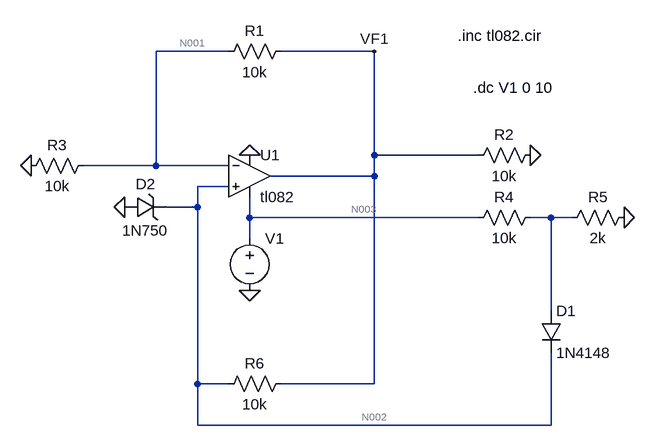
[diagram p0: schematic exp_10_2.asc]
exp_10_2.asc, the LTspice schematic file:
Version 4
SHEET 1 1092 680
WIRE 208 -80 96 -80
WIRE 432 -80 288 -80
WIRE 432 80 432 -80
WIRE 592 80 432 80
WIRE 96 96 96 -80
WIRE 96 96 -16 96
WIRE 208 96 96 96
WIRE 432 112 432 80
WIRE 432 112 272 112
WIRE 208 128 160 128
WIRE 160 160 160 128
WIRE 160 160 112 160
WIRE 240 176 240 144
WIRE 592 176 240 176
WIRE 704 176 672 176
WIRE 736 176 704 176
WIRE 240 208 240 176
WIRE 704 320 704 176
WIRE 160 432 160 160
WIRE 208 432 160 432
WIRE 432 432 432 112
WIRE 432 432 288 432
WIRE 160 496 160 432
WIRE 704 496 704 384
WIRE 704 496 160 496
FLAG 672 80 0
FLAG 816 176 0
FLAG -96 96 0
FLAG 240 80 0
FLAG 240 288 0
FLAG 48 160 0
FLAG 432 -80 VF1
SYMBOL diode 688 320 R0
SYMATTR InstName D1
SYMATTR Value 1N4148
SYMBOL Opamps\\opamp2 240 48 R0
SYMATTR InstName U1
SYMATTR Value tl082
SYMBOL res 304 -96 R90
WINDOW 0 0 56 VBottom 2
WINDOW 3 32 56 VTop 2
SYMATTR InstName R1
SYMATTR Value 10k
SYMBOL res 688 64 R90
WINDOW 0 0 56 VBottom 2
WINDOW 3 32 56 VTop 2
SYMATTR InstName R2
SYMATTR Value 10k
SYMBOL res 0 80 R90
WINDOW 0 0 56 VBottom 2
WINDOW 3 32 56 VTop 2
SYMATTR InstName R3
SYMATTR Value 10k
SYMBOL res 688 160 R90
WINDOW 0 0 56 VBottom 2
WINDOW 3 32 56 VTop 2
SYMATTR InstName R4
SYMATTR Value 10k
SYMBOL res 832 160 R90
WINDOW 0 0 56 VBottom 2
WINDOW 3 32 56 VTop 2
SYMATTR InstName R5
SYMATTR Value 2k
SYMBOL res 304 416 R90
WINDOW 0 0 56 VBottom 2
WINDOW 3 32 56 VTop 2
SYMATTR InstName R6
SYMATTR Value 10k
SYMBOL voltage 240 192 R0
WINDOW 123 0 0 Left 0
WINDOW 39 0 0 Left 0
SYMATTR InstName V1
SYMATTR Value ""
SYMBOL zener 48 176 R270
WINDOW 0 36 32 VTop 2
WINDOW 3 -4 32 VBottom 2
SYMATTR InstName D2
SYMATTR Value 1N750
TEXT 560 -104 Left 2 !.inc tl082.cir
TEXT 584 -24 Left 2 !.dc V1 0 10

The netlist it stands for:
* exp_10_2.asc
D1 N004 N002 1N4148
XU1 N002 N001 0 N003 VF1 tl082  ; pins In+ In- V+ V- OUT
R1 VF1 N001 10k
R2 0 VF1 10k
R3 N001 0 10k
R4 N004 N003 10k
R5 0 N004 2k
R6 VF1 N002 10k
V1 N003 0
D2 0 N002 1N750
.model D D
.lib standard.dio
.inc tl082.cir
.dc V1 0 10
.backanno
.end

* Results of the author's LTspice run, read from the files saved beside the schematic
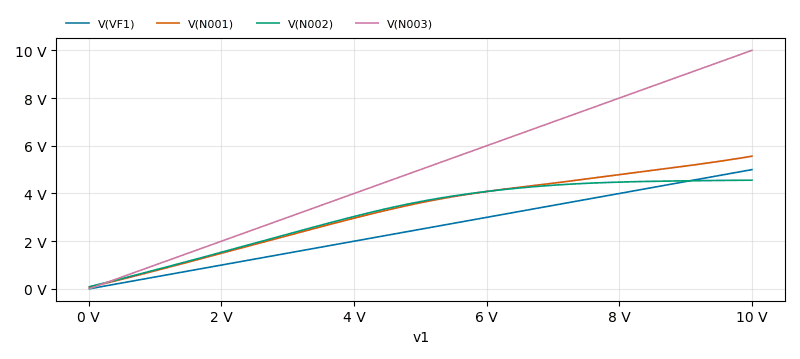
[diagram p1: DC transfer characteristic of exp_10_2.asc, plotted from the saved traces]
* DC transfer characteristic, 1 run:
*   V(VF1): 5 mV at v1=10 mV, 5 V at v1=10 V, min 5 mV, max 5 V
*   V(N001): 77.72 mV at v1=10 mV, 5.562 V at v1=10 V, min 77.72 mV, max 5.562 V
*   V(N002): 91.89 mV at v1=10 mV, 4.558 V at v1=10 V, min 91.89 mV, max 4.559 V
*   V(N003): 10 mV at v1=10 mV, 10 V at v1=10 V, min 10 mV, max 10 V